# EAGLE board KMO_IO_MV2_91 (EAGLE 9.4.2)
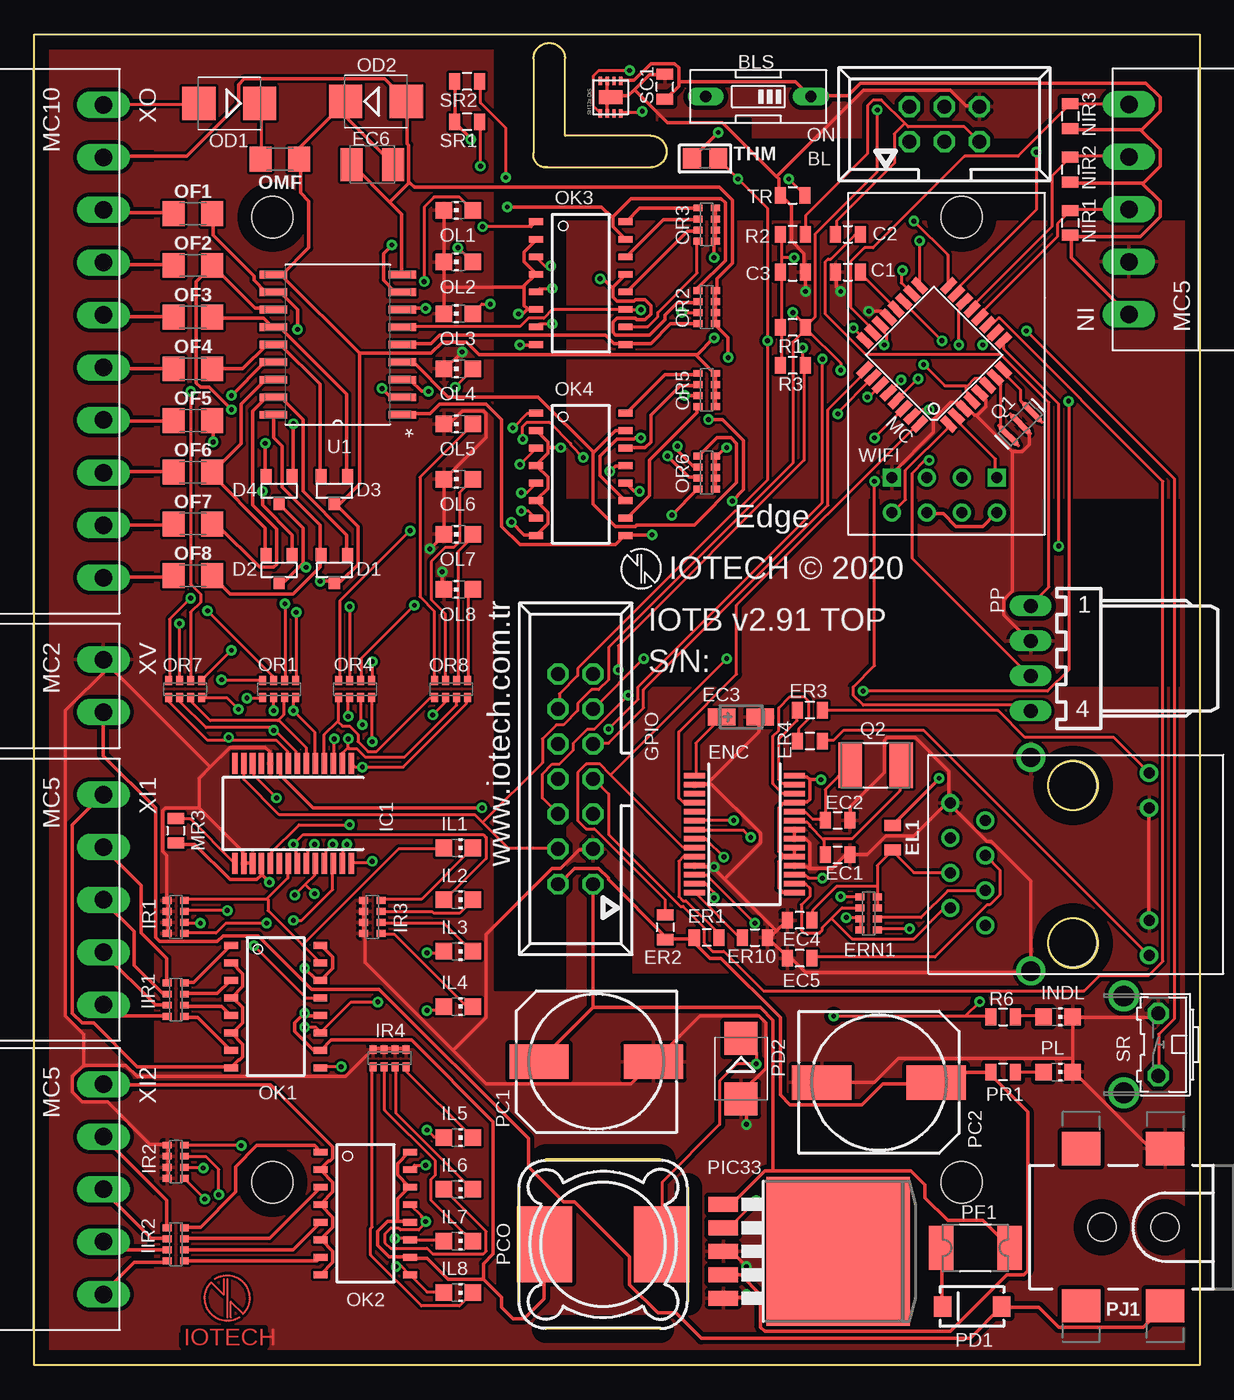
[diagram p2: board, top side]
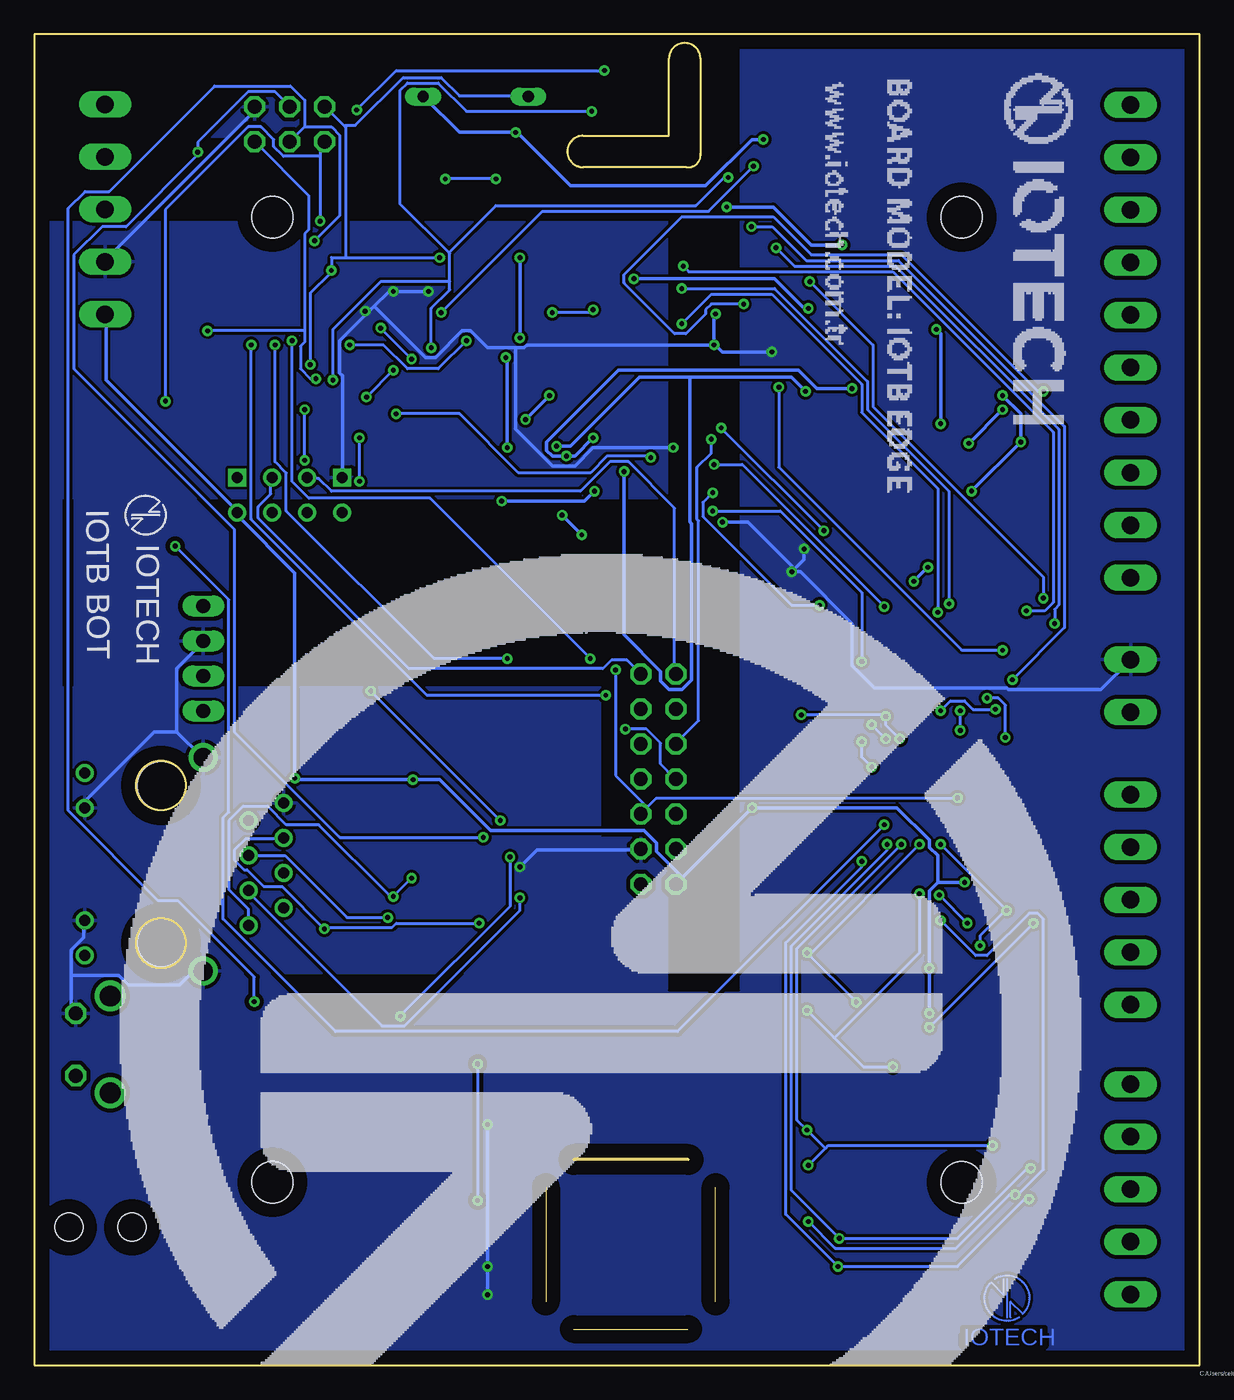
[diagram p3: board, bottom side, seen from below]

Size 84.5 x 96.5 mm. Coordinates in mm from the lower left corner, seen from the top.
Outline: 0,0 0,96.5 84.5,96.5 84.5,0 0,0
Outline: 36.2,94.74 36.2,87.88 arc106 37.21,86.87 44.7,86.87 arc180 44.7,89.15 38.48,89.15 38.48,94.74 arc180 36.2,94.74
Copper layers (1*16): Top 0.035mm / dielectric 1.5mm / Bottom 0.035mm
Design rules "KMO_IO_M": minimum track width 6mil, minimum drill 0.35mm, track to track 0.205mm, track to pad 0.205mm, pad to pad 0.205mm, via to via 0.205mm, smd to smd 6mil, copper to edge 40mil, drill to drill 6mil, minimum pad ring 10mil, minimum via ring 8mil, stop-mask expansion 4mil, vias tented up to drill 0mil, thermal gap 10mil
Net classes: 0 default: width 0.203 mm, drill 0.3 mm, clearance 0.16 mm; 1 COM1: width 0.254 mm, drill 0.3 mm, clearance 0.16 mm to class 0, clearance 0.16 mm; 2 3.3V: width 0.254 mm, drill 0.3 mm, clearance 0.16 mm to class 0, clearance 0.16 mm to class 1, clearance 0.16 mm; 3 MAX_24V: width 0.254 mm, drill 0.3 mm, clearance 0.16 mm to class 0, clearance 0.16 mm to class 1, clearance 0.16 mm to class 2, clearance 0.16 mm; 4 RAW: width 0.254 mm, drill 0.3 mm, clearance 0.16 mm to class 0, clearance 0.16 mm to class 1, clearance 0.16 mm to class 2, clearance 0.16 mm to class 3, clearance 0.16 mm; 5 COM2: width 0.254 mm, drill 0.3 mm, clearance 0.16 mm to class 0, clearance 0.16 mm to class 1, clearance 0.16 mm to class 2, clearance 0.16 mm to class 3, clearance 0.16 mm to class 4, clearance 0.16 mm
Holes 3 mm at 17.25,83.25 67.25,83.25 17.25,13.25 67.25,13.25

## Footprints (pad centres in the part's own frame; a part is rotated, then mirrored left to right if it is on the bottom)
057-006-1 = drill 1 octagon: 1 -2.54,-1.27; 2 -2.54,1.27; 3 0,-1.27; 4 0,1.27; 5 2.54,-1.27; 6 2.54,1.27
EDG-01 = drill 0.813 long: 1 0,-3.81; 2 0,3.81
0805 = smd 0.8 x 1.2: 1 -0.9,0; 2 0.9,0
SOT-23-3 = smd 0.802 x 0.972: 1 -0.95,-1; 2 0.95,-1; 3 0,1
CT3216 = smd 2 x 1.2: + -1.4,0; - 1.4,0
SMC_B = smd 1.6 x 2.4: + -1.5,0; - 1.5,0
SSOP28 = smd 0.4 x 1.5: 1 -4.225,-3.625; 2 -3.575,-3.625; 3 -2.925,-3.625; 4 -2.275,-3.625; 5 -1.625,-3.625; 6 -0.975,-3.625; 7 -0.325,-3.625; 8 0.325,-3.625; 9 0.975,-3.625; 10 1.625,-3.625; 11 2.275,-3.625; 12 2.925,-3.625; 13 3.575,-3.625; 14 4.225,-3.625; 15 4.225,3.625; 16 3.575,3.625; 17 2.925,3.625; 18 2.275,3.625; 19 1.625,3.625; 20 0.975,3.625; 21 0.325,3.625; 22 -0.325,3.625; 23 -0.975,3.625; 24 -1.625,3.625; 25 -2.275,3.625; 26 -2.925,3.625; 27 -3.575,3.625; 28 -4.225,3.625
0603-ARV = smd 0.5 x 0.65: 1 -1.2,-0.625; 2 -0.4,-0.625; 3 0.4,-0.625; 4 1.2,-0.625; 5 1.2,0.625; 6 0.4,0.625; 7 -0.4,0.625; 8 -1.2,0.625
057-014-1 = drill 1 octagon: 1 -7.62,-1.27; 2 -7.62,1.27; 3 -5.08,-1.27; 4 -5.08,1.27; 5 -2.54,-1.27; 6 -2.54,1.27; 7 0,-1.27; 8 0,1.27; 9 2.54,-1.27; 10 2.54,1.27; 11 5.08,-1.27; 12 5.08,1.27; 13 7.62,-1.27; 14 7.62,1.27
CHIP-LED0805 = smd 1.2 x 1.2: A 0,-1.05; C 0,1.05
TQFP32-08 = smd 1.27 x 0.559: 1 -4.293,2.8; 2 -4.293,2; 3 -4.293,1.2; 4 -4.293,0.4; 5 -4.293,-0.4; 6 -4.293,-1.2; 7 -4.293,-2; 8 -4.293,-2.8; 17 4.293,-2.8; 18 4.293,-2; 19 4.293,-1.2; 20 4.293,-0.4; 21 4.293,0.4; 22 4.293,1.2; 23 4.293,2; 24 4.293,2.8 | smd 0.559 x 1.27: 9 -2.8,-4.293; 10 -2,-4.293; 11 -1.2,-4.293; 12 -0.4,-4.293; 13 0.4,-4.293; 14 1.2,-4.293; 15 2,-4.293; 16 2.8,-4.293; 25 2.8,4.293; 26 2,4.293; 27 1.2,4.293; 28 0.4,4.293; 29 -0.4,4.293; 30 -1.2,4.293; 31 -2,4.293; 32 -2.8,4.293
MC5 = drill 1.27 long: 1 -7.62,0; 2 -3.81,0; 3 0,0; 4 3.81,0; 5 7.62,0
SMB = smd 2.4 x 2.4: A 2.2,0; C -2.2,0
1206 = smd 1.6 x 1.8: 1 -1.4,0; 2 1.4,0
MINI-FLAT-16 = smd 1 x 0.5: 1 -3.24,4.445; 2 -3.24,3.175; 3 -3.24,1.905; 4 -3.24,0.635; 5 -3.24,-0.635; 6 -3.24,-1.905; 7 -3.24,-3.175; 8 -3.24,-4.445; 9 3.24,-4.445; 10 3.24,-3.175; 11 3.24,-1.905; 12 3.24,-0.635; 13 3.24,0.635; 14 3.24,1.905; 15 3.24,3.175; 16 3.24,4.445
140CLH-1010 = smd 4.3 x 2.5: + 4.15,0; - -4.15,0
MSS1260 = smd 5.5 x 4: P$1 0,4.25; P$2 0,-4.25
SMA-DIODE = smd 1.27 x 1.47: A -2.15,0; C 2.15,0
1820 = smd 1.78 x 3.2: 1 -2.49,0; 2 2.49,0
TO263-5 = smd 1.067 x 2.159: 1 -3.404,-5.791; 2 -1.702,-5.791; 3 0,-5.791; 4 1.702,-5.791; 5 3.404,-5.791 | smd 10.8 x 10.41: 6 0,2.54
POWER_JACK_SMD_OVERPASTE_TOE = smd 2.8 x 2.4: GND 0,-5.7; P$4 6.1,-5.7; VIN0 0,5.7; VIN1 6.1,5.7 | hole 2.032: 0,0; 4.572,0
7395-04 = drill 1.016 long: 1 3.81,0; 2 1.27,0; 3 -1.27,0; 4 -3.81,0
RESONATOR-SMD-1:1 = smd 0.45 x 1.905: 1 -1.2,0; 2 0,0; 3 1.2,0
5.0X3.2_2 = smd 1.7 x 3.3: 1 -1.85,0; 2 1.85,0
SHT3X = smd 0.55 x 0.25: ADDR -1.175,0.25; ALERT -1.175,-0.25; GND 1.175,0.75; R 1.175,0.25; RESET 1.175,-0.25; SCL -1.175,-0.75; SDA -1.175,0.75; VDD 1.175,-0.75 | smd 1 x 1.7: GND_PAD 0,-0.025
B3F-31XX = drill 1.016 octagon: 1 -2.261,-1.245; 2 2.261,-1.245 | drill 1.499 pad 2.159: 3 -3.505,1.245; 4 3.505,1.245
MICROBUILDER_0805_NOTHERMALS = smd 1.3 x 1.5: 1 -0.95,0; 2 0.95,0
SOIC127P1030X265-18N = smd 1.981 x 0.559: 1 -4.674,5.08; 2 -4.674,3.81; 3 -4.674,2.54; 4 -4.674,1.27; 5 -4.674,0; 6 -4.674,-1.27; 7 -4.674,-2.54; 8 -4.674,-3.81; 9 -4.674,-5.08; 10 4.674,-5.08; 11 4.674,-3.81; 12 4.674,-2.54; 13 4.674,-1.27; 14 4.674,0; 15 4.674,1.27; 16 4.674,2.54; 17 4.674,3.81; 18 4.674,5.08
RJ45 = drill 0.8: G+ 5.84,-6.305; G- 5.84,-3.765; GND -8.57,4.76; NC -6.03,3.5; P4 -8.57,-0.32; P5 -6.03,0.96; RD+ -6.03,-1.58; RD- -8.57,2.22; TD+ -6.03,-4.12; TD- -8.57,-2.86; Y+ 5.84,6.945; Y- 5.84,4.405 | drill 1.4: SHIELD1 -2.73,-7.425; SHIELD2 -2.73,8.065 | hole 3.5: 0.3,-5.38; 0.3,6.02
ESP01 = drill 0.8: CH_PD -1.285,-8.178; GPIO0 1.255,-5.638; GPIO2 -1.285,-5.638; RST 1.255,-8.178; TX -3.825,-8.178; VCC 3.795,-8.178 | drill 0.8 square: GND -3.825,-5.638; RX 3.795,-5.638
MC10 = drill 1.27 long: 1 -17.145,0; 2 -13.335,0; 3 -9.525,0; 4 -5.715,0; 5 -1.905,0; 6 1.905,0; 7 5.715,0; 8 9.525,0; 9 13.335,0; 10 17.145,0
MC2 = drill 1.27 long: 1 -1.905,0; 2 1.905,0

## Placement (x,y rotation side)
BL  057-006-1  [057-006-1]  66,90 0 top
BLS  ON  [EDG-01]  52.5,92 90 top
C1  100nF  [0805]  59,79.26 0 top
C2  100nF  [0805]  59,82.01 0 top
C3  100nF  [0805]  55,79.26 0 top
D1  BAV70  [SOT-23-3]  21.75,57.75 180 top
D2  BAV70  [SOT-23-3]  17.75,57.75 180 top
D3  BAV70  [SOT-23-3]  21.75,63.5 180 top
D4  BAV70  [SOT-23-3]  17.75,63.5 180 top
EC1  18p  [0805]  58.25,37 0 top
EC2  18p  [0805]  58.25,39.5 0 top
EC3  10u  [CT3216]  51.25,47 0 top
EC4  10n  [0805]  55.5,32.25 180 top
EC5  10n  [0805]  55.5,29.5 180 top
EC6  10u 25V B  [SMC_B]  24.5,87.07 180 top
EL1  10µH  [0805]  62.25,38.25 270 top
ENC  ENC28J60-SSOP  [SSOP28]  51.5,38.5 270 top
ER1  10k  [0805]  48.75,31 180 top
ER2  10k  [0805]  45.75,31.75 270 top
ER3  1k  [0805]  56.25,47.5 180 top
ER4  1k  [0805]  56.25,45.25 180 top
ER10  2.7K  [0805]  52.25,31 0 top
ERN1  49.9R  [0603-ARV]  60.5,32.75 270 top
GPIO  057-014-1  [057-014-1]  39.25,42.5 90 top
IC1  MCP23017SS  [SSOP28]  18.75,40 180 top
IIR1  6.8K  [0603-ARV]  10.25,26.5 270 top
IIR2  6.8K  [0603-ARV]  10.25,8.75 270 top
IL1  BLU  [CHIP-LED0805]  30.75,37.5 270 top
IL2  BLU  [CHIP-LED0805]  30.75,33.75 270 top
IL3  BLU  [CHIP-LED0805]  30.75,30 270 top
IL4  BLU  [CHIP-LED0805]  30.75,26 270 top
IL5  BLU  [CHIP-LED0805]  30.75,16.5 270 top
IL6  BLU  [CHIP-LED0805]  30.75,12.75 270 top
IL7  BLU  [CHIP-LED0805]  30.75,9 270 top
IL8  BLU  [CHIP-LED0805]  30.75,5.25 270 top
INDL  BLU  [CHIP-LED0805]  74.25,25.25 270 top
IR1  10K  [0603-ARV]  10.25,32.5 90 top
IR2  10K  [0603-ARV]  10.25,14.75 90 top
IR3  1K  [0603-ARV]  24.5,32.5 270 top
IR4  1K  [0603-ARV]  25.75,22.25 180 top
MC  ATMEGA328  [TQFP32-08]  65.25,73.26 135 top
MR3  10K  [0805]  10.25,38.75 270 top
NI  MC5  [MC5]  79.38,83.82 90 top
NIR1  4700  [0805]  75.12,82.84 270 top
NIR2  4700  [0805]  75.12,86.7 270 top
NIR3  4700  [0805]  75.12,90.56 270 top
OD1  SS54  [SMB]  14.13,91.5 180 top
OD2  28V  [SMB]  24.77,91.64 0 top
OF1  200mA  [1206]  11.5,83.5 0 top
OF2  200mA  [1206]  11.5,79.75 0 top
OF3  200mA  [1206]  11.5,76 0 top
OF4  200mA  [1206]  11.5,72.25 0 top
OF5  200mA  [1206]  11.5,68.5 0 top
OF6  200mA  [1206]  11.5,64.75 0 top
OF7  200mA  [1206]  11.5,61 0 top
OF8  200mA  [1206]  11.5,57.25 0 top
OK1  TLP283-4  [MINI-FLAT-16]  17.5,26 0 top
OK2  TLP283-4  [MINI-FLAT-16]  24,11 0 top
OK3  TLP283-4  [MINI-FLAT-16]  39.63,78.46 0 top
OK4  TLP283-4  [MINI-FLAT-16]  39.62,64.59 0 top
OL1  BLU  [CHIP-LED0805]  30.75,83.75 90 top
OL2  BLU  [CHIP-LED0805]  30.75,80 90 top
OL3  BLU  [CHIP-LED0805]  30.75,76.25 90 top
OL4  BLU  [CHIP-LED0805]  30.75,72.25 90 top
OL5  BLU  [CHIP-LED0805]  30.75,68.25 90 top
OL6  BLU  [CHIP-LED0805]  30.75,64.25 90 top
OL7  BLU  [CHIP-LED0805]  30.75,60.25 90 top
OL8  BLU  [CHIP-LED0805]  30.75,56.25 90 top
OMF  2A  [1206]  17.8,87.45 180 top
OR1  1K  [0603-ARV]  17.75,49.02 180 top
OR2  10K  [0603-ARV]  48.75,76.72 270 top
OR3  10K  [0603-ARV]  48.75,82.72 270 top
OR4  1K  [0603-ARV]  23.25,49.02 180 top
OR5  10K  [0603-ARV]  48.75,70.72 270 top
OR6  10K  [0603-ARV]  48.75,64.72 270 top
OR7  1K  [0603-ARV]  10.92,49.02 180 top
OR8  1K  [0603-ARV]  30.23,49.02 180 top
PC1  220uf 50v  [140CLH-1010]  40.75,22 180 top
PC2  220uf 50v  [140CLH-1010]  61.25,20.5 0 top
PCO  220 uh  [MSS1260]  41.25,8.75 90 top
PD1  M7  [SMA-DIODE]  68,4.25 180 top
PD2  SS54  [SMB]  51.25,21.5 270 top
PF1  1A  [1820]  68.25,8.5 0 top
PIC33  LM2596S-3.3  [TO263-5]  55.75,8.25 270 top
PJ1  POWER_JACKTOE  [POWER_JACK_SMD_OVERPASTE_TOE]  82,10 180 top
PL  GRN  [CHIP-LED0805]  74.25,21.25 270 top
PP  22-05-7048-04  [7395-04]  72.25,51.25 90 top
PR1  1k  [0805]  70.25,21.25 180 top
Q1  8MHz  [RESONATOR-SMD-1:1]  71.5,68.26 45 top
Q2  25MHz  [5.0X3.2_2]  61,43.5 0 top
R1  1.5K  [0805]  55,75.25 180 top
R2  10K  [0805]  55,82.01 180 top
R3  1.5K  [0805]  55,72.5 180 top
R6  1k  [0805]  70.25,25.25 0 top
SC1  100nF  [0805]  45.72,92.71 90 top
SHT  SHT3X  [SHT3X]  41.78,91.95 90 top
SR  gnd  [B3F-31XX]  80.25,23.25 90 top
SR1  10K  [0805]  31.37,90.17 180 top
SR2  10K  [0805]  31.37,93.09 180 top
THM  THERM  [MICROBUILDER_0805_NOTHERMALS]  48.64,87.5 0 top
TR  10K  [0805]  54.99,84.84 0 top
U1  ULN2803ADW  [SOIC127P1030X265-18N]  22,74 180 top
U$1  [IOTECH_COPPER_W_TEXT]  13.98,4.86 0 top
U$2  HR911105A  [RJ45]  75,36 0 top
U$4  [IOTECH_COPPER_W_TEXT]  13.97,4.86 0 bottom
WIFI  ESP01  [ESP01]  66,70 0 top
XI1  MC5  [MC5]  5,33.75 270 top
XI2  MC5  [MC5]  5,12.75 270 top
XO  MC10  [MC10]  5,74.25 270 top
XV  MC2  [MC2]  5,49.25 270 top

## Tracks (layer width: path | path; a pad name or v marks a point on that pad's centre or on a via)
+3V3  (via drill 0.35)
  Top 0.254: PIC33.4 50.01,6.53 51.23,6.53 52.66,5.1 52.66,2.75 52.96,2.45 66.44,2.45 70.52,6.53 71.74,6.53 72.05,6.84 72.05,18.37 69.29,21.12 PR1.2 69.29,21.23 66.13,21.23 65.41,20.51 PC2.+ 65.31,20.41 61.54,20.41 60.01,18.88 54.8,18.88 54.09,19.59 54.09,25.21 49.8,29.49 48.98,29.49 47.66,30.82 ER1.2 47.76,30.92 45.82,30.92 ER2.2 45.82,31.02 41.64,35.21 41.64,35.31 40.92,36.02 39.19,36.02 38.06,34.9 GPIO.2 | 26.33,10.41 27.14,10.41 OK2.12 | 26.33,10.41 25.61,10.41 24.9,9.7 24.9,8.67 25.72,7.86 27.14,7.86 OK2.10 27.35,7.76 28.47,7.76 30,6.22 32.55,6.22 | 26.33,10.41 26.33,12.04 27.14,12.86 OK2.14 27.14,12.96 26.33,13.78 26.33,14.59 27.14,15.41 OK2.16 | 32.55,6.22 33.88,4.9 33.88,4.18 34.7,3.37 35.51,3.37 36.94,4.8 36.94,8.67 PCO.P$1 | 16.43,35.51 16.12,35.21 14.19,35.21 11.63,37.76 10.31,37.76 MR3.2 | 16.43,35.51 16.43,36.33 IC1.18 | OK1.16 20.82,30.41 21.64,29.59 21.64,28.78 20.82,27.96 OK1.14 20.72,27.96 20.41,27.96 v19.59,28.78 | 19.59,25.31 20.72,25.31 OK1.12 | 19.59,25.31 19.39,25.31 18.88,24.8 18.88,24.19 20.21,22.86 20.72,22.86 OK1.10 20.82,22.86 21.53,23.57 27.35,23.57 33.27,17.66 33.27,8.06 32.55,7.35 32.55,6.22 | v19.59,25.51 19.59,25.31 | v17.04,35 16.53,35.51 16.43,35.51 | v32.45,40.41 20.21,40.41 17.86,42.76 17.86,43.58 IC1.9 | 46.74,93.07 46.74,92.76 45.82,91.84 SC1.1 | 46.74,93.07 46.74,94.09 46.43,94.4 44.7,94.4 43.47,93.17 42.55,93.17 SHT.VDD | SR2.2 30.51,93.07 30.51,90.21 SR1.2 30.51,90.11 31.64,88.99 v31.64,88.89 | v49.6,89.4 47.76,87.56 THM.1 | 46.74,93.07 55.21,93.07 56.23,92.05 BLS.1 56.33,92.05 58.98,92.05 59.9,92.97 80.62,92.97 81.64,91.95 81.64,90.93 80.31,89.6 80.21,89.6
  Top 0.254: NI.1 79.29,76.23 75.21,80.31 75.21,81.84 NIR1.2 75.31,81.84 80.21,81.84 81.64,83.27 81.64,84.39 80.31,85.72 | 80.31,85.72 75.21,85.72 NIR2.2 | 80.21,89.6 75.21,89.6 NIR3.2 | 80.21,89.6 81.64,88.17 81.64,86.95 80.42,85.72 80.31,85.72 | 56.23,42.45 56.23,41.02 56.02,40.82 55.21,40.82 ENC.25 55.11,40.72 54.29,40.72 53.98,40.41 53.98,37.25 54.29,36.94 54.29,36.84 | 56.23,42.45 56.02,42.66 55.21,42.66 ENC.28 | 54.29,36.84 53.98,36.53 53.98,34.59 54.29,34.29 55.11,34.29 ENC.15 | 54.29,36.84 55.11,36.84 ENC.19 55.11,36.94 55.11,37.45 ENC.20 | v65.62,42.55 62.25,39.19 EL1.1 | WIFI.CH_PD 64.8,61.74 65.92,61.74 66.84,60.82 68.78,60.82 69.7,61.74 WIFI.VCC | v57.05,42.45 56.23,42.45
  Bottom 0.254: v19.59,25.51 v19.59,28.78 19.59,34.39 18.98,35 | 18.98,35 v17.04,35 | 18.98,35 18.98,36.94 19.59,37.55 19.59,38.06 21.94,40.41 v32.45,40.41 37.96,34.9 GPIO.2 37.55,35.41 39.39,37.25 39.39,37.86 40.31,38.78 51.43,38.78 55.11,42.45 v57.05,42.45 65.62,42.45 v65.62,42.55 65.62,57.45 69.7,61.54 69.7,61.74 WIFI.VCC 69.8,61.94 79.29,71.44 79.29,76.13 NI.1 | BLS.1 56.23,91.95 53.68,89.4 v49.6,89.4 49.49,89.4 45.62,85.52 35.82,85.52 32.45,88.89 v31.64,88.89
A0
  Top 0.203: NI.5 79.29,91.44 75.21,91.44 NIR3.1 75.11,91.44 71.33,87.66 67.45,87.66 60.82,81.03 60.21,81.03 59.19,80.01 59.19,76.74 60.72,75.21 60.72,74.91 MC.23
A1  (via drill 0.35)
  Top 0.203: v59.39,75.21 60.21,74.39 MC.24 | v57.15,72.97 57.15,62.56 43.78,49.19 43.78,48.27 v41.64,46.13
  Bottom 0.203: v57.15,72.97 v59.39,75.21 | v41.64,46.13 40.11,46.13 39.09,45.11 39.09,43.58 38.06,42.55 GPIO.8
A2
  Top 0.203: MC.25 60.21,72.15 60.21,71.94 57.56,69.29 57.56,62.35 44.19,48.98 44.19,47.66 41.64,45.11 40.62,45.11 GPIO.9
A3  (via drill 0.35)
  Top 0.203: v58.27,68.99 58.27,69.09 60.72,71.54 MC.26 | v39.8,65.82 38.88,66.74 38.88,66.84 37.35,68.37 35.72,68.37 35.41,68.07 v35.41,67.15
  Bottom 0.203: v58.27,68.99 53.68,68.99 49.39,64.7 44.19,64.7 42.96,65.92 39.9,65.92 v39.8,65.82 | v35.41,67.15 35.41,66.13 36.43,65.11 36.43,61.33 36.33,61.23 36.33,46.74 37.96,45.11 GPIO.10
A4  (via drill 0.35)
  Top 0.203: 32.5,39.34 34.39,37.45 37.96,37.45 GPIO.4 | 32.5,39.34 31.94,39.9 17.76,39.9 15.21,42.45 15.21,43.58 IC1.13 | v43.17,93.89 40.92,93.89 40.51,93.48 40.51,91.33 41.02,90.83 SHT.SDA | v61.13,91.03 61.13,86.54 56.64,82.05 56.64,76.03 55.92,75.31 R1.1 | v32.35,86.95 32.35,90.11 SR1.1 | v55.01,76.33 55.92,75.42 R1.1 | v60.41,70.21 60.52,70.21 61.33,71.03 MC.27 | v58.48,72.15 58.48,72.66 55.92,75.21 R1.1 | 32.5,39.34 36.84,43.68 36.84,45.41 37.86,46.43 38.37,46.43 39.39,47.45 39.39,47.96 40.41,48.98 40.92,48.98 41.64,49.7 41.64,52.05 55.01,65.41 55.01,74.19 55.92,75.11 R1.1
  Bottom 0.203: v43.17,93.89 58.27,93.89 v61.13,91.03 | v32.35,86.95 35.62,83.68 47.66,83.68 v55.01,76.33 | v58.48,72.15 v60.41,70.21
A5  (via drill 0.35)
  Top 0.203: v17.55,41.13 15.92,42.76 15.92,43.58 IC1.12 | v44.09,90.93 43.98,90.83 42.55,90.83 SHT.SCL | v55.72,73.78 55.72,72.66 55.82,72.56 R3.1 55.82,72.46 55.82,65.62 42.35,52.15 v42.35,50.41 | v34.19,86.13 34.19,89.7 32.35,91.54 32.35,93.07 SR2.1 | v62.86,71.44 61.94,70.52 MC.28
  Bottom 0.203: v17.55,41.13 39.39,41.13 40.51,40 GPIO.5 40.11,40.51 42.35,42.76 v42.35,50.41 | v44.09,90.93 53.17,90.93 55.21,92.97 57.45,92.97 57.96,92.46 57.96,84.19 54.44,80.67 | 54.44,80.67 54.39,80.62 54.39,78.58 | 54.39,78.58 54.39,77.97 55.72,76.64 v55.72,73.78 | v34.19,86.13 34.49,86.13 36.53,84.09 51.02,84.09 54.44,80.67 | v62.86,71.44 62.86,75.11 59.39,78.58 54.39,78.58
A6  (via drill 0.35)
  Top 0.203: v65.82,74.29 63.07,77.05 MC.19 | v44.19,51.23 40.62,47.66 GPIO.11
  Bottom 0.203: v65.82,74.29 65.82,64.09 64.6,62.86 55.82,62.86 v44.19,51.23
A7  (via drill 0.35)
  Top 0.203: v54.7,86.03 55.82,84.91 TR.2 | THM.2 49.6,87.46 v51.02,86.03 53.17,83.89 v53.17,74.29 53.17,64.19 50.92,61.94 50.82,61.94 39.39,50.52 39.39,50.01 38.06,48.68 38.06,47.66 GPIO.12 | v61.64,73.99 61.84,74.19 61.84,74.7 61.43,75.11 61.43,75.42 MC.22
  Bottom 0.203: v51.02,86.03 v54.7,86.03 | v61.64,73.99 59.19,73.99 57.45,72.25 55.21,72.25 v53.17,74.29
AREF
  Top 0.203: C1.2 59.9,79.19 62.45,76.64 MC.20
BLV  (via drill 0.35)
  Top 0.203: R3.2 54.19,72.56 54.19,75.21 R1.2 54.19,75.31 54.19,79.19 C3.1 54.19,79.29 54.19,80.31 | 54.19,80.31 54.19,81.95 R2.2 | 67.61,70.98 68.17,71.54 68.68,71.54 69.09,71.13 MC.6 | 67.61,70.98 67.56,70.92 67.56,70.62 67.97,70.21 67.97,70.01 MC.4 | v62.96,79.39 62.88,79.39 62.87,79.38 62.87,78.49 63.58,77.76 MC.18 | v64.5,72.56 66.03,71.03 67.56,71.03 67.61,70.98 | v55.11,80.31 54.19,80.31
  Bottom 0.203: 61.94,80.31 61.94,89.8 61.99,89.86 | 61.99,89.86 63.37,91.23 BL.2 | 64.5,77.74 v64.5,72.56 | 64.5,77.74 62.96,79.28 v62.96,79.39 62.96,80.31 61.94,80.31 | 64.5,77.74 | BLS.2 48.78,92.05 53.68,92.05 55.01,93.38 57.76,93.38 61.23,89.91 61.94,89.91 61.99,89.86 | 61.94,80.31 v55.11,80.31
COM1
  Top 0.254: OK1.2 14.29,29.19 15.1,28.37 15.1,27.45 14.29,26.64 OK1.4 14.39,26.64 15.1,25.92 15.1,24.8 14.39,24.08 OK1.6 14.29,24.08 15.1,23.27 15.1,22.35 14.9,22.14 14.8,22.14 14.29,21.64 OK1.8 14.19,21.64 7.45,21.64 4.29,24.8 3.47,24.8 2.75,25.51 2.75,39.19 4.9,41.33 XI1.1
COM2
  Top 0.254: OK2.8 20.82,6.63 21.64,7.45 21.64,8.27 20.82,9.08 OK2.6 20.82,9.18 21.64,10 21.64,10.71 20.82,11.53 OK2.4 20.82,11.74 21.64,12.55 21.64,13.27 20.82,14.08 OK2.2 20.82,14.29 21.33,14.8 21.43,14.8 21.64,15 21.64,15.82 17.14,20.31 5,20.31 XI2.1
D2
  Top 0.203: MC.32 64.19,68.17 63.98,68.17 50.92,55.11 50.92,50.11 46.74,45.92 46.74,41.13 47.05,40.82 47.86,40.82 ENC.4
D3
  Top 0.203: MC.1 66.23,68.17 66.23,67.97 63.17,64.9 63.17,62.76 62.25,61.84 WIFI.TX
D4
  Top 0.203: MC.2 66.94,68.78 66.94,68.48 69.7,65.72 69.7,64.39 WIFI.RX
D5  (via drill 0.35)
  Top 0.203: v74.29,59.39 74.29,69.7 70.31,73.68 70.31,74.29 MC.9 | v22.86,39.19 19.18,39.19 17.14,37.15 17.14,36.43 IC1.19
  Bottom 0.203: v74.29,59.39 70.42,55.52 70.42,40.11 70.82,39.7 70.82,32.35 62.66,24.19 37.86,24.19 v22.86,39.19
D6  (via drill 0.35)
  Top 0.203: v68.78,73.99 69.6,74.8 MC.10 | v43.06,48.58 40.62,46.13 40.11,46.13 39.09,45.11 39.09,44.6 38.06,43.58 37.55,43.58 36.84,42.86 36.84,41.13 37.96,40 GPIO.6
  Bottom 0.203: v68.78,73.99 68.78,61.33 56.02,48.58 v43.06,48.58
D7
  Top 0.203: MC.11 69.19,75.52 69.5,75.52 69.9,75.92 70.01,75.92 81.84,64.09 81.84,29.29 80.82,28.27 77.25,28.27 76.13,27.14 52.86,27.14 50.01,30 49.19,30 48.58,30.61 48.58,31.74 47.05,33.27 46.84,33.27 41.64,38.47 41.64,41.43 40.62,42.45 GPIO.7
D8
  Top 0.203: NI.3 79.29,83.78 75.21,83.78 NIR1.1 75.11,83.68 74.19,82.76 74.19,81.84 68.58,76.23 68.58,76.03 MC.12
D9
  Top 0.203: NI.4 79.29,87.66 75.21,87.66 NIR2.1 75.11,87.56 73.78,86.23 73.78,82.56 68.07,76.84 68.07,76.64 MC.13
D10  (via drill 0.35)
  Top 0.203: 41.79,42.81 47.05,37.55 47.86,37.55 ENC.9 | 41.79,42.81 41.02,43.58 40,43.58 39.39,42.96 39.39,39.49 40,38.88 40.62,38.88 45.72,33.78 45.72,32.66 ER2.1 | v67.05,73.99 67.05,76.54 67.35,76.84 67.35,77.05 MC.14 | 41.79,42.81 v50.21,51.23
  Bottom 0.203: v67.05,73.99 67.05,65.52 66.23,64.7 66.23,61.94 55.52,51.23 v50.21,51.23
D11  (via drill 0.35)
  Top 0.203: v72.66,87.97 72.66,83.78 66.94,78.07 66.94,77.76 MC.15 | v51.94,38.27 51.43,38.78 47.96,38.78 ENC.7
  Bottom 0.203: BL.4 66.03,91.33 67.05,92.36 68.99,92.36 72.66,88.68 v72.66,87.97 72.66,87.76 77.86,82.56 79.6,82.56 81.64,80.52 81.64,72.25 70.01,60.62 70.01,45.92 62.35,38.27 v51.94,38.27
D12  (via drill 0.35)
  Top 0.203: v63.78,82.97 66.23,80.52 66.23,78.37 MC.16 | v50.72,39.49 47.96,39.49 ENC.6 | v60.11,48.88 73.48,48.88 75.01,50.41 v75.01,69.9
  Bottom 0.203: 63.78,87.66 63.78,88.38 63.48,88.68 BL.1 | 63.78,87.66 v63.78,82.97 | v60.11,48.88 v50.72,39.49 | v75.01,69.9 75.01,83.78 68.99,89.8 68.07,89.8 67.15,88.89 67.15,88.38 66.44,87.66 63.78,87.66
D13  (via drill 0.35)
  Top 0.203: v64.19,81.54 64.19,78.37 MC.17 | v57.96,25.31 67.51,25.31 | 67.51,25.31 69.29,25.31 R6.1 | v50.01,36.84 48.68,38.17 47.96,38.17 ENC.8 | 67.51,25.31 v68.56,26.35
  Bottom 0.203: v64.19,81.54 62.35,83.38 62.35,89.19 62.97,89.8 64.9,89.8 | 64.9,89.8 65.92,88.78 BL.3 | v57.96,25.31 50.01,33.27 v50.01,36.84 | 64.9,89.8 64.9,91.74 65.92,92.76 71.44,92.76 79.09,85.11 80.82,85.11 82.05,83.89 82.05,40.21 75.52,33.68 74.09,33.68 68.56,28.15 v68.56,26.35
DTR
  Top 0.203: C2.2 59.8,81.95 59.49,81.95 57.76,80.21 57.56,80.21 57.35,80.01 57.35,76.23 60.31,73.27 70.11,73.27 73.58,69.8 73.58,56.43 72.25,55.11 PP.1
EP4
  Top 0.203: ERN1.7 61.13,33.17 61.13,33.88 ERN1.8 61.13,33.98 61.13,34.7 | 61.13,34.7 61.13,36.23 62.15,37.25 EL1.2 62.25,37.25 63.78,35.72 66.33,35.72 U$2.P4 | 61.13,34.7 58.17,34.7 56.43,32.96 56.43,32.35 EC4.1
EP5  (via drill 0.35)
  Top 0.203: ERN1.4 59.9,31.64 59.9,32.35 ERN1.3 59.8,32.45 v58.88,32.45 | EC5.1 56.43,29.59 65.31,29.59 69.09,33.37 69.29,33.37 70.01,34.09 70.01,35.92 68.99,36.94 U$2.P5
  Bottom 0.203: v58.88,32.45 61.84,32.45 66.33,36.94 68.88,36.94 U$2.P5
GND  (via drill 0.35)
  Top 0.254: IR2.8 9.7,13.57 9.7,14.29 IR2.7 9.7,14.39 9.7,15.1 IR2.6 9.7,15.21 9.7,15.92 IR2.5 9.59,16.02 8.37,16.02 5.31,19.08 3.47,19.08 2.75,19.8 2.75,20.92 3.57,21.74 | IR4.1 26.94,22.96 26.23,22.96 IR4.2 26.12,22.96 25.41,22.96 IR4.3 25.31,22.96 24.59,22.96 IR4.4 24.49,22.86 22.55,20.92 7.45,20.92 6.63,21.74 3.57,21.74 | 37.25,66.54 37.25,66.94 36.43,67.76 OK4.2 | 37.25,66.54 37.25,66.13 36.43,65.31 OK4.4 36.43,65.21 37.25,64.39 37.25,63.58 36.43,62.76 OK4.6 36.43,62.66 37.25,61.84 37.25,61.03 36.43,60.21 OK4.8 36.33,60.21 35.51,60.21 v34.59,61.13 | v29.57,57.53 29.57,56.38 OL8.C | v28.68,59.19 29.7,60.21 OL7.C 29.7,60.31 29.7,64.19 OL6.C 29.8,64.29 32.76,67.25 32.76,68.99 32.55,69.19 31.02,69.19 30.11,68.27 29.8,68.27 OL5.C | IR1.8 9.7,31.33 9.7,32.04 IR1.7 9.7,32.15 9.7,32.86 IR1.6 9.7,32.96 9.7,33.68 IR1.5 9.59,33.78 9.59,36.94 9.29,37.25 9.29,40.21 9.49,40.41 11.94,40.41 | 11.94,40.41 15.1,37.25 15.1,36.43 IC1.16 15.21,36.43 15.82,36.43 IC1.17 | 12.76,43.37 11.94,42.55 11.94,40.41 | 12.76,43.37 14.19,44.8 16.74,44.8 17.04,44.49 17.04,43.68 IC1.10 | 12.76,43.37 5,51.13 XV.1 5.41,50.62 2.25,47.45 2.25,25.31 3.57,23.98 3.57,21.74 | SHT.GND 41.13,93.17 41.43,93.17 SHT.R 41.53,93.07 41.53,92.25 41.74,92.05 SHT.GND_PAD | SHT.ADDR 41.53,90.83 41.53,91.74 41.74,91.95 SHT.GND_PAD | 43.52,92.51 43.06,92.05 41.84,92.05 SHT.GND_PAD | 43.52,92.51 44.6,93.58 45.72,93.58 SC1.2 | 43.52,92.51 45.92,90.11 49.9,90.11 53.83,86.18 | 53.83,86.18 53.98,86.03 53.98,84.91 TR.1 54.19,84.8 54.9,84.09 54.9,81.54 55.82,80.62 55.82,79.29 C3.2 55.92,79.19 v55.92,77.86
  Top 0.254: 53.83,86.18 60.11,92.46 66.44,92.46 67.56,91.33 68.48,91.33 BL.6 | 29.7,78.17 29.7,79.91 OL2.C 29.7,80.11 29.7,83.68 OL1.C | 29.7,78.17 29.7,76.33 OL3.C | v35.21,73.99 36.33,73.99 OK3.8 | v35.1,76.23 35.41,76.23 35.72,76.54 | 35.72,76.54 36.33,76.54 OK3.6 | 35.51,78.17 35.51,76.84 35.72,76.64 35.72,76.54 | 35.51,78.17 35.51,78.27 36.33,79.09 OK3.4 36.33,79.19 35.51,80.01 35.51,80.72 36.33,81.54 OK3.2 | v31.02,73.48 29.8,72.25 OL4.C | 35.51,78.17 29.7,78.17 | 68.37,68.88 68.17,68.88 67.76,69.29 67.45,69.29 MC.3 67.35,69.39 66.94,69.8 66.44,69.8 65.21,68.58 65.21,67.66 62.25,64.7 62.25,64.39 WIFI.GND | 68.37,68.88 68.99,69.5 68.99,70.01 68.58,70.42 MC.5 | 70.92,66.23 71.64,66.23 72.15,66.74 72.15,67.45 Q1.2 | 70.92,66.23 68.37,68.78 68.37,68.88 | v58.48,77.86 58.17,78.17 58.17,79.19 C1.1 | v60.52,76.44 61.43,76.44 61.84,76.03 MC.21 | v51.64,5.1 51.43,4.9 50.01,4.9 PIC33.5 | v51.64,7.14 50.62,8.16 50.01,8.16 PIC33.3 | IR3.1 23.88,33.68 23.88,32.96 IR3.2 23.88,32.86 23.88,32.15 IR3.3 23.88,32.04 23.88,31.33 IR3.4 23.98,31.23 23.98,29.19 30.36,22.81 | 30.36,22.81 32.76,20.41 43.27,20.41 44.8,21.94 PC1.- 45,22.04 48.27,25.31 52.56,25.31 53.07,24.8 53.07,21.53 51.33,19.8 51.33,19.39 PD2.A 51.23,19.18 51.64,18.78 v51.64,17.45 | 30.36,22.81 32.76,25.21 32.76,31.23 37.55,36.02 38.17,36.02 39.49,37.35 40.51,37.35 GPIO.3 | 48.93,42.3 52.56,45.92 52.56,46.94 EC3.- | 48.93,42.3 48.78,42.15 47.96,42.15 ENC.2 | 53.83,31.48 EC4.2 | 53.83,31.48 53.37,31.02 53.17,31.02 ER10.2 53.27,30.92 54.6,29.59 EC5.2 54.7,29.49 54.9,29.49 55.92,28.47 72.25,28.47 U$2.SHIELD1 72.25,28.68 72.25,35.1 69.39,37.96 69.09,37.96 66.54,40.51 66.54,40.72 U$2.GND
  Top 0.254: 49.19,36.13 47.96,36.13 ENC.11 | 53.83,31.48 50.06,35.26 | 50.06,35.26 49.19,36.13 | 48.93,42.3 52.66,38.58 52.66,37.86 50.06,35.26 | ENC.22 55.11,38.78 55.11,38.27 ENC.21 55.21,38.17 55.92,38.17 56.23,37.86 56.23,36.02 | 56.23,36.02 56.13,36.02 56.02,36.13 55.21,36.13 ENC.18 | 56.23,36.02 57.86,36.02 58.78,36.94 59.09,36.94 EC1.2 59.19,37.04 60.41,37.04 61.74,38.37 63.78,38.37 66.23,40.82 U$2.GND | EC2.2 59.19,39.59 59.19,40.51 61.64,42.96 61.64,45.31 61.84,45.51 63.88,45.51 66.33,43.06 66.33,40.82 U$2.GND | 75.31,22.25 75.31,25.21 INDL.C 75.42,25.21 81.23,25.21 81.44,25.41 SR.2 | 75.31,22.25 75.31,21.33 PL.C 75.42,21.23 80.93,15.72 81.95,15.72 PJ1.GND | U$2.Y- 80.82,40.31 80.82,32.25 U$2.G- | 75.31,22.25 62.66,22.25 60.92,20.51 57.15,20.51 PC2.- | v49.29,36.13 49.19,36.13 | 70.92,66.23 70.92,56.13 70.31,55.52 70.31,54.39 72.15,52.56 PP.2 | v38.17,66.54 37.25,66.54
  Bottom 0.254: v28.68,59.19 28.68,58.43 v29.57,57.53 | v34.59,61.13 32.76,61.13 29.57,57.94 v29.57,57.53 | v29.57,57.53 28.96,57.53 25.21,53.78 25.21,50.72 23.57,49.09 13.98,49.09 13.88,48.98 7.14,48.98 5,51.13 XV.1 | BL.6 68.58,91.23 68.58,90.93 79.39,80.11 NI.2 | v35.21,73.99 35.21,76.13 v35.1,76.23 | v31.02,73.48 34.59,73.48 35.1,73.99 v35.21,73.99 | 60.36,76.28 62.35,74.29 62.35,71.94 62.15,71.74 62.15,64.39 WIFI.GND | 60.36,76.28 59.85,76.79 | 59.85,76.79 58.78,77.86 v58.48,77.86 v55.92,77.86 | 60.36,76.28 v60.52,76.44 | v35.21,73.99 48.78,73.99 48.98,73.78 49.6,73.78 | 49.6,73.78 51.64,73.78 52.86,75.01 53.47,75.01 55.41,73.07 56.13,73.07 59.85,76.79 | v51.64,5.1 v51.64,7.14 v51.64,17.45 | 74.19,45.92 74.19,50.52 72.25,52.45 PP.2 | 74.19,45.92 72.35,44.09 U$2.SHIELD2 | 81.84,28.27 81.84,25.82 81.54,25.51 SR.2 | 81.84,28.27 81.84,30.11 80.93,31.02 80.93,32.15 U$2.G- | 81.84,28.27 78.37,28.27 77.66,27.55 73.99,27.55 72.97,28.57 72.35,28.57 U$2.SHIELD1 | 74.19,45.92 75.82,45.92 80.82,40.92 80.82,40.41 U$2.Y- | v49.29,36.13 48.07,37.35 40.62,37.35 GPIO.3 | v38.17,66.54 43.98,66.54 45.31,65.21 46.94,65.21 49.6,67.86 49.6,73.78
  pour Top (isolate 0.305): -3.12,98.3 87,98.3 87,-1.65 -3.94,-1.65 -3.94,97.48
  pour Bottom (isolate 0.305): -5.33,99.44 88.01,99.44 88.01,-3.17 -5.33,-3.17
  cutout Top: 38.48,94.74 44.96,94.74 44.96,88.9 38.48,88.9
  cutout Bottom: 38.48,94.74 44.96,94.74 44.96,88.9 38.48,88.9
  pour Top: 43.43,49.15 84.45,49.15 84.45,28.45 43.43,28.45
  pour Bottom: 43.43,49.15 84.45,49.15 84.45,28.45 43.43,28.45
  cutout Bottom: 45.34,90.42 51.94,90.42 51.94,84.58 45.34,84.58
  cutout Top: 45.34,90.42 51.94,90.42 51.94,84.58 45.34,84.58
  pour Bottom: 8.76,94.11 33.4,94.11 33.4,2.41 8.76,2.41
  pour Top: 8.76,94.11 33.4,94.11 33.4,2.41 8.76,2.41
  cutout Top: 33.4,96.52 38.35,96.52 38.48,96.65 38.48,27.18 33.4,27.18
  cutout Bottom: 33.4,96.52 38.35,96.52 38.48,96.65 38.48,27.18 33.4,27.18
  pour Bottom: 38.48,83.06 84.45,83.06 84.45,62.87 38.48,62.87
  pour Top: 38.48,83.06 84.45,83.06 84.45,62.87 38.48,62.87
  cutout Top: 84.58,83.06 38.35,83.06 38.35,88.9 84.58,88.9 84.58,82.93
  cutout Bottom: 84.58,83.06 38.35,83.06 38.35,88.9 84.58,88.9 84.58,82.93
GNDO  (via drill 0.35)
  Top 0.254: OR6.5 49.39,63.58 49.39,64.29 OR6.6 49.39,64.39 49.39,65.01 OR6.7 49.39,65.21 49.39,65.82 OR6.8 49.49,65.92 50.11,66.54 v50.21,66.54 | v50.31,73.07 50.31,74.5 49.39,75.42 OR2.5 49.39,75.62 49.39,76.23 OR2.6 49.39,76.44 49.39,77.05 OR2.7 49.39,77.15 49.39,77.86 OR2.8 49.49,77.97 49.49,78.78 50.62,79.91 50.62,84.5 49.7,85.42 27.55,85.42 27.25,85.72 27.14,85.72 | 25.77,84.34 23.06,87.05 EC6.- | 25.77,84.34 26.64,83.48 26.64,79.09 U1.9 | 27.14,85.72 27.14,88.48 27.04,88.58 27.04,91.64 OD2.A 26.94,91.74 25.41,93.27 15.21,93.27 14.8,92.86 14.8,91.44 11.02,87.66 5,87.66 XO.2 | 25.77,84.34 27.14,85.72
  Bottom 0.254: v50.21,66.54 50.21,72.97 v50.31,73.07
GPA0
  Top 0.203: 16.89,33.83 18.37,35.31 18.37,36.33 IC1.21 | 16.89,33.83 16.84,33.78 10.92,33.78 IR1.4 | 19.44,30.46 16.94,32.96 16.94,33.78 16.89,33.83 | 19.44,30.46 20.72,29.19 OK1.15 | 19.44,30.46 26.43,37.45 29.7,37.45 IL1.A
GPA1  (via drill 0.35)
  Top 0.203: v13.98,32.96 10.92,32.96 IR1.3 | IC1.22 18.98,36.43 18.98,37.25 18.78,37.45 v18.78,37.76 19.49,38.47 32.55,38.47 32.76,38.27 32.76,36.74 29.8,33.78 IL2.A | v15.92,30.41 19.7,26.64 20.72,26.64 OK1.13
  Bottom 0.203: v18.78,37.76 v13.98,32.96 14.08,32.96 15.92,31.12 v15.92,30.41
GPA2  (via drill 0.35)
  Top 0.203: v12.04,32.04 10.92,32.04 IR1.2 | v19.59,24.49 20.41,24.49 20.72,24.19 OK1.11 20.82,24.19 22.96,26.33 v24.9,26.33 | v28.47,29.9 29.7,29.9 IL3.A | v20.31,37.76 19.8,37.25 19.8,36.43 IC1.23
  Bottom 0.203: v19.59,24.49 v12.04,32.04 | v24.9,26.33 v28.47,29.9 28.27,29.8 v20.31,37.76
GPA3  (via drill 0.35)
  Top 0.203: v22.25,21.64 20.82,21.64 OK1.9 | v28.47,25.72 29.49,25.72 29.7,25.92 IL4.A | v16.84,32.04 13.88,32.04 13.16,31.33 10.92,31.33 IR1.1 | 19.64,34.85 20.31,35.51 20.31,36.33 IC1.24 | 19.64,34.85 v18.88,34.09 | 19.64,34.85 v20.31,34.19
  Bottom 0.203: v22.25,21.64 24.39,21.64 26.48,23.73 | v28.47,25.72 26.48,23.73 | v18.88,34.09 v16.84,32.04 | 26.48,23.73 20.31,29.9 v20.31,34.19
GPA4  (via drill 0.35)
  Top 0.203: v15,15.92 10.92,15.92 IR2.4 | v28.37,14.49 27.55,14.49 OK2.15 | v28.47,17.04 28.98,16.53 29.7,16.53 IL5.A | v21.64,37.76 21.12,37.25 21.12,36.43 IC1.25
  Bottom 0.203: v15,15.92 26.94,15.92 27.14,15.72 | v28.37,14.49 27.14,15.72 | 27.14,15.72 v28.47,17.04 29.19,17.76 29.19,30.21 v21.64,37.76
GPA5  (via drill 0.35)
  Top 0.203: v13.37,12.35 13.37,14.19 12.45,15.1 10.92,15.1 IR2.3 | OK2.13 28.06,10.82 28.06,10.71 v28.37,10.41 28.27,10.41 28.27,10.21 27.86,9.8 26.53,9.8 26.43,9.9 25.82,9.9 25.41,9.49 25.41,8.88 25.82,8.47 28.47,8.47 28.88,8.06 32.55,8.06 32.76,8.27 32.76,9.7 29.8,12.65 IL6.A | v18.78,32.25 19.39,32.25 21.64,34.49 21.64,36.33 IC1.26
  Bottom 0.203: v28.37,10.41 26.43,8.47 17.66,8.47 13.78,12.35 v13.37,12.35 13.16,12.35 11.33,14.19 11.33,32.35 11.74,32.76 12.35,32.76 15.41,29.7 16.23,29.7 v18.78,32.25
GPA6  (via drill 0.35)
  Top 0.203: v12.25,14.29 10.92,14.29 IR2.2 | v26.12,9.18 27.14,9.18 OK2.11 27.25,9.08 29.7,9.08 IL7.A | v22.66,37.76 22.35,37.45 22.35,36.43 IC1.27
  Bottom 0.203: v12.25,14.29 12.45,14.29 17.55,9.18 v26.12,9.18 29.59,12.65 29.59,30.41 22.66,37.35 v22.66,37.76
GPA7  (via drill 0.35)
  Top 0.203: v12.35,12.04 10.92,13.47 IR2.1 | v26.23,7.14 26.64,7.14 27.14,6.63 OK2.9 27.25,6.53 28.47,5.31 29.7,5.31 IL8.A | v24.49,36.53 24.39,36.43 23.06,36.43 IC1.28
  Bottom 0.203: v12.35,12.04 12.65,12.04 17.55,7.14 v26.23,7.14 30,10.92 30,30.61 24.49,36.13 v24.49,36.53
GPB0  (via drill 0.35)
  Top 0.203: v24.49,45.21 24.49,48.37 OR4.8 | IC1.1 23.06,43.58 23.27,43.37 v23.78,43.37 26.74,43.37 31.33,47.96 31.33,48.37 OR8.8
  Bottom 0.203: v24.49,45.21 24.49,44.09 v23.78,43.37
GPB1  (via drill 0.35)
  Top 0.203: v23.78,46.43 23.68,46.53 23.68,48.37 OR4.7 | v22.76,45.41 22.76,44.8 22.71,44.75 | 22.71,44.75 22.35,44.39 22.35,43.68 IC1.2 | OR8.7 30.61,48.37 30.61,47.86 26.84,44.09 23.98,44.09 23.37,44.7 22.76,44.7 22.71,44.75
  Bottom 0.203: v22.76,45.41 v23.78,46.43
GPB2  (via drill 0.35)
  Top 0.203: v22.76,47.05 22.76,48.37 OR4.6 | v21.74,45.41 21.74,43.68 IC1.3 | v28.88,47.15 29.8,48.07 29.8,48.37 OR8.6
  Bottom 0.203: v21.74,45.41 22.76,46.43 v22.76,47.05 22.86,47.15 v28.88,47.15
GPB3
  Top 0.203: 21.99,46.69 21.02,45.72 21.02,43.68 IC1.4 | 21.99,46.69 22.04,46.74 22.04,48.37 OR4.5 | 21.99,46.69 22.35,46.33 22.86,46.33 23.47,45.72 23.47,45.21 24.19,44.49 24.8,44.49 28.68,48.37 28.98,48.37 OR8.5
GPB4  (via drill 0.35)
  Top 0.203: v14.8,47.55 13.98,48.37 12.14,48.37 OR7.8 | OR1.8 18.88,48.37 18.78,48.27 v18.78,47.45 20.31,45.92 20.31,43.68 IC1.5
  Bottom 0.203: v14.8,47.55 16.43,47.55 17.04,48.17 18.06,48.17 v18.78,47.45
GPB5
  Top 0.203: 17.71,46.79 18.06,47.15 18.06,48.37 OR1.7 | 17.71,46.79 17.66,46.74 12.76,46.74 11.33,48.17 11.33,48.37 OR7.7 | 17.71,46.79 19.7,44.8 19.7,43.68 IC1.6
GPB6  (via drill 0.35)
  Top 0.203: 17.4,46.08 18.98,44.49 18.98,43.68 IC1.7 | 17.4,46.08 17.25,46.23 12.45,46.23 10.61,48.07 10.61,48.37 OR7.6 | v17.35,47.45 17.35,48.37 OR1.6 | v17.35,46.02 17.4,46.08
  Bottom 0.203: v17.35,46.02 v17.35,47.45
GPB7  (via drill 0.35)
  Top 0.203: 14.08,45.31 17.55,45.31 18.37,44.49 18.37,43.68 IC1.8 | 14.08,45.31 12.55,45.31 9.8,48.07 9.8,48.37 OR7.5 | v15.41,48.37 16.53,48.37 OR1.5 | 14.08,45.31 v14.08,45.51
  Bottom 0.203: v15.41,48.37 14.59,48.37 14.08,47.86 v14.08,45.51
IO5
  Top 0.254: 40.51,66.13 40.51,62.45 42.15,60.82 43.58,60.82 43.68,60.92 47.86,60.92 50.92,63.98 50.92,66.84 50.52,67.25 49.49,67.25 48.17,65.92 OR6.1 | 40.51,66.13 42.15,67.76 OK4.15 | U1.4 26.74,72.66 27.55,72.66 30,70.21 36.53,70.21 40.51,66.23 40.51,66.13
IO6  (via drill 0.35)
  Top 0.254: v46.64,66.64 46.64,66.33 47.76,65.21 48.07,65.21 OR6.2 | v28.57,70.62 28.06,70.62 27.25,71.44 26.74,71.44 U1.3 | v41.74,64.8 42.15,65.21 42.86,65.21 OK4.13
  Bottom 0.254: v46.64,66.64 45.62,66.64 40.62,71.64 36.94,71.64 | 36.94,71.64 29.59,71.64 v28.57,70.62 | v41.74,64.8 41.74,52.96 39.09,50.31 39.09,49.6 38.47,48.98 37.55,48.98 36.84,49.7 36.84,61.03 36.94,61.13 36.94,71.64
IO7  (via drill 0.35)
  Top 0.254: v45.92,65.92 47.45,64.39 48.07,64.39 OR6.3 | v43.98,67.25 43.58,67.25 43.47,67.15 42.25,67.15 41.02,65.92 41.02,64.5 42.86,62.66 OK4.11 | v25.21,70.82 25.82,70.21 26.64,70.21 U1.2
  Bottom 0.254: v43.98,67.25 45.31,65.92 v45.92,65.92 46.94,65.92 47.35,66.33 47.35,66.94 42.15,72.15 29.08,72.15 27.76,70.82 v25.21,70.82
IO8  (via drill 0.35)
  Top 0.254: v46.23,61.64 48.07,63.48 OR6.4 | v44.8,60.21 42.96,60.21 OK4.9 42.76,60.11 42.15,59.49 35.21,59.49 33.88,60.82 33.88,68.58 32.76,69.7 29.39,69.7 28.68,68.99 26.74,68.99 U1.1
  Bottom 0.254: v44.8,60.21 v46.23,61.64
LEDA
  Top 0.203: ER3.1 57.25,47.45 69.9,47.45 71.84,45.51 78.27,45.51 80.82,42.96 U$2.Y+
LEDB
  Top 0.203: ER4.1 57.25,45.31 57.96,45.31 58.68,46.02 64.5,46.02 80.82,29.7 U$2.G+
N$1
  Top 0.203: OD1.A 11.84,91.44 5,91.44 XO.1
N$2
  Top 0.254: PD1.C 65.82,4.29 65.82,8.47 PF1.1
N$3
  Top 0.203: MR3.1 10.31,39.59 11.33,39.59 14.49,36.43 IC1.15
N$4
  Top 0.203: OMF.2 16.43,87.46 16.43,91.44 OD1.C
N$5
  Top 0.203: R6.2 71.23,25.31 73.17,25.31 INDL.A
N$6
  Top 0.254: OF8.1 10,57.15 5,57.15 XO.10
N$7
  Top 0.254: D1.1 22.66,58.78 22.66,60.21 19.49,63.37 19.49,68.58 17.96,70.11 17.35,70.11 U1.17 17.25,70.11 16.74,70.11 15.82,69.19 15.82,62.35 17.55,60.62 17.55,58.07 17.35,57.86 16.33,57.86 13.27,60.92 12.96,60.92 OF7.2
N$8  (via drill 0.35)
  Top 0.203: v13.57,49.7 16.53,49.7 OR1.4 | v32.5,82.56 36.02,82.56 36.33,82.86 OK3.1
  Bottom 0.203: v13.57,49.7 9.8,53.47 9.8,68.07 21.84,80.11 28.52,80.11 30.99,82.55 31.24,82.55 31.25,82.56 v32.5,82.56
N$9
  Top 0.203: ER3.2 55.31,47.45 55.31,46.74 53.98,45.41 53.98,42.45 54.29,42.15 55.11,42.15 ENC.27
N$10
  Top 0.203: MC.8 70.31,72.15 70.31,71.94 71.54,70.72 71.54,69.92 Q1.3
N$11
  Top 0.203: PR1.1 71.23,21.23 73.17,21.23 PL.A
N$12
  Top 0.203: IR3.8 25.21,33.78 28.06,33.78 31.74,37.45 IL1.C
N$13
  Top 0.203: ENC.1 47.96,42.76 47.96,45.11 49.8,46.94 EC3.+
N$14
  Top 0.203: ER4.2 55.41,45.31 55.41,46.13 56.13,46.84 56.13,48.17 55.82,48.47 54.8,48.47 53.98,47.66 53.98,46.02 53.58,45.62 53.58,42.15 54.29,41.43 55.11,41.43 ENC.26
N$15
  Top 0.203: MC.7 69.7,71.54 70.11,71.13 70.11,68.07 Q1.1
N$16  (via drill 0.35)
  Top 0.203: v52.35,11.94 50.41,10 50.01,10 PIC33.2 | PD2.C 51.33,23.68 52.35,22.66 v52.35,21.84 50.92,21.84 49.7,20.61 49.7,17.45 45.51,13.27 45.51,8.78 PCO.P$2
  Bottom 0.203: v52.35,21.84 v52.35,11.94
N$17
  Top 0.203: ER1.1 49.6,31.02 49.6,31.33 47.25,33.68 47.05,33.68 46.74,33.98 46.74,36.53 47.05,36.84 47.86,36.84 ENC.10
N$18
  Top 0.254: IIR1.1 9.59,27.76 9.59,29.49 7.76,31.33 7.76,34.8 XI1.2
N$19
  Top 0.203: ER10.1 51.33,31.02 51.13,31.02 47.96,34.19 ENC.14
N$20
  Top 0.203: IR3.7 25.21,32.86 28.88,32.86 28.98,32.76 30.82,32.76 31.74,33.68 IL2.C
N$21
  Top 0.203: IR3.6 25.21,32.04 29.7,32.04 31.74,30 IL3.C
N$22
  Top 0.203: ENC.24 55.21,40.11 55.92,40.11 56.43,39.59 57.25,39.59 EC2.1 57.35,39.59 57.35,41.74 59.09,43.47 Q2.1
N$23
  Top 0.203: IR3.5 25.21,31.23 26.12,31.23 31.33,26.02 31.74,26.02 IL4.C
N$24
  Top 0.203: 57.2,38.12 56.23,39.09 56.23,39.19 56.02,39.39 55.21,39.39 ENC.23 | 57.2,38.12 57.25,38.06 57.25,37.04 EC1.1 | 57.2,38.12 57.25,38.17 59.29,38.17 62.76,41.64 62.76,43.47 Q2.2
N$25
  Top 0.203: IR4.8 27.04,21.53 27.04,21.23 31.74,16.53 IL5.C
N$26
  Top 0.203: IR4.7 26.23,21.53 26.23,18.27 31.74,12.76 IL6.C
N$27
  Top 0.203: IR4.6 25.41,21.53 25.41,18.47 29.08,14.8 29.08,13.78 28.78,13.47 28.78,11.94 31.74,8.98 IL7.C
N$28
  Top 0.254: IIR1.2 9.59,26.94 9.29,26.94 7.25,28.98 7.25,31.43 5,33.68 XI1.3
N$29
  Top 0.254: IIR1.8 10.92,27.76 11.53,27.76 14.19,30.41 OK1.1
N$30
  Top 0.254: IIR1.7 10.92,26.94 13.27,26.94 14.19,27.86 OK1.3
N$31
  Top 0.254: IIR1.6 10.92,26.02 13.57,26.02 14.19,25.41 OK1.5
N$32
  Top 0.254: IIR1.5 10.92,25.21 11.84,25.21 14.19,22.86 OK1.7
N$33
  Top 0.254: IIR1.3 9.59,26.12 8.78,26.12 5,29.9 XI1.4
N$34
  Top 0.254: IIR1.4 9.59,25.31 5.82,25.31 XI1.5
N$35  (via drill 0.35)
  Top 0.203: v12.55,54.7 17.35,49.9 17.35,49.7 OR1.3 | v37.45,79.7 37.04,79.7 36.43,80.31 OK3.3
  Bottom 0.203: v12.55,54.7 11.23,54.7 10.61,55.31 10.61,67.66 22.25,79.29 37.04,79.29 v37.45,79.7
N$36
  Top 0.254: IIR2.1 9.59,10 9.59,11.94 5,16.53 XI2.2
N$37
  Top 0.254: IIR2.8 10.92,10 12.04,10 14.59,12.55 14.59,14.39 16.12,15.92 20.31,15.92 20.72,15.51 OK2.1
N$38
  Top 0.254: IIR2.2 9.59,9.18 8.47,9.18 5,12.65 XI2.3
N$39
  Top 0.254: IIR2.7 10.92,9.18 17.04,9.18 20.72,12.86 OK2.3
N$40
  Top 0.254: IIR2.3 9.59,8.37 5.51,8.37 5,8.88 XI2.4
N$41
  Top 0.254: IIR2.6 10.92,8.37 18.78,8.37 20.72,10.31 OK2.5
N$42
  Top 0.254: IIR2.4 9.59,7.45 7.25,7.45 5,5.21 XI2.5
N$43
  Top 0.254: IIR2.5 10.92,7.55 20.51,7.55 20.72,7.76 OK2.7
N$44
  Top 0.203: IR4.5 24.49,21.53 24.49,10 24.39,9.9 24.39,7.96 28.06,4.29 30.82,4.29 31.74,5.21 IL8.C
N$45  (via drill 0.35)
  Top 0.203: v18.16,55.21 18.16,49.7 OR1.2 | v37.55,78.07 36.64,78.07 36.43,77.86 OK3.5
  Bottom 0.203: v18.16,55.21 18.16,63.37 24.08,69.29 24.08,71.33 30.82,78.07 v37.55,78.07
N$46  (via drill 0.35)
  Top 0.203: v18.98,54.6 18.98,49.7 OR1.1 | v37.55,75.52 36.64,75.52 36.43,75.31 OK3.7
  Bottom 0.203: v18.98,54.6 18.98,63.58 24.49,69.09 24.49,71.13 31.02,77.66 35.41,77.66 v37.55,75.52
N$47
  Top 0.254: OF8.2 12.96,57.15 14.19,55.92 18.78,55.92 20.72,57.86 20.72,58.68 D1.2 20.72,58.78 20.72,60.92 17.96,63.68 17.96,66.64 17.35,67.25 17.35,68.88 U1.18
N$48
  Top 0.254: OR3.1 48.07,83.89 43.88,83.89 42.96,82.97 OK3.16
N$49
  Top 0.254: D2.2 16.74,58.78 16.74,60.72 12.96,64.5 12.96,64.7 OF6.2 12.96,64.8 15,66.84 15,69.7 16.74,71.44 17.25,71.44 U1.16
N$50  (via drill 0.35)
  Top 0.254: v16.53,63.37 16.53,62.35 18.68,60.21 18.68,58.78 D2.1 | v12.96,66.94 12.96,68.48 OF5.2 | v14.29,70.31 16.63,72.66 17.25,72.66 U1.15
  Bottom 0.254: v16.53,63.37 v12.96,66.94 12.96,68.99 v14.29,70.31
N$51
  Top 0.254: OF7.1 10,60.92 5,60.92 XO.9
N$52
  Top 0.254: OF6.1 10,64.8 5,64.8 XO.8
N$53
  Top 0.254: OR3.2 48.07,83.07 45.62,83.07 42.96,80.42 OK3.14
N$54
  Top 0.254: OF5.1 10,68.48 5,68.48 XO.7
N$55
  Top 0.254: OF4.1 10,72.25 5,72.25 XO.6
N$56
  Top 0.254: OR3.3 48.07,82.25 47.35,82.25 42.96,77.86 OK3.12
N$57
  Top 0.254: D3.1 22.66,64.6 22.66,70.42 17.86,75.21 17.35,75.21 U1.13 17.25,75.31 16.63,75.92 12.96,75.92 OF3.2
N$58
  Top 0.203: OR3.4 48.07,81.44 48.07,79.19 45.21,76.33 45.21,76.03 44.49,75.31 42.96,75.31 OK3.10
N$59  (via drill 0.35)
  Top 0.254: v16.74,66.84 16.74,64.6 D4.2 | v14.29,69.29 12.65,70.92 12.04,70.92 11.74,71.23 11.74,78.58 12.86,79.7 OF2.2 12.96,79.7 16.02,76.64 17.25,76.64 U1.12
  Bottom 0.254: v14.29,69.29 v16.74,66.84
N$60  (via drill 0.35)
  Top 0.203: v11.33,55.62 9.8,54.09 9.8,49.7 OR7.4 | v28.27,78.58 28.27,83.99 28.98,84.7 30.82,84.7 31.74,83.78 OL1.A
  Bottom 0.203: v11.33,55.62 11.33,57.15 23.68,69.5 23.68,73.99 v28.27,78.58
N$61  (via drill 0.35)
  Top 0.203: v10.51,53.78 10.51,49.7 OR7.3 | v30.72,81.03 31.74,80.01 OL2.A
  Bottom 0.203: v10.51,53.78 10.51,54.8 10.21,55.11 10.21,67.86 22.04,79.7 29.39,79.7 v30.72,81.03
N$62  (via drill 0.35)
  Top 0.203: v11.33,70.62 11.33,56.64 12.04,55.92 12.04,55.31 11.33,54.6 11.33,49.7 OR7.2 | v33.06,76.95 32.45,76.95 31.84,76.33 OL3.A
  Bottom 0.203: v11.33,70.62 11.74,70.62 21.64,80.52 28.17,80.52 30.92,83.27 37.55,83.27 41.74,79.09 41.74,78.48 38.06,74.8 37.25,74.8 35.82,76.23 35.82,76.54 35.41,76.95 v33.06,76.95
N$63  (via drill 0.35)
  Top 0.203: v14.29,51.84 12.14,49.7 OR7.1 | v30.51,70.92 31.74,72.15 OL4.A
  Bottom 0.203: v14.29,51.84 17.25,51.84 30.51,65.11 v30.51,70.92
N$64  (via drill 0.35)
  Top 0.254: v18.78,68.27 18.78,64.6 D4.1 | v19.08,75.11 19.08,76.54 17.86,77.76 17.35,77.76 U1.11 17.25,77.86 16.74,77.86 15.92,78.68 15.92,78.99 12.96,81.95 12.96,83.48 OF1.2
  Bottom 0.254: v18.78,68.27 18.78,74.8 v19.08,75.11
N$65
  Top 0.254: D3.2 20.72,64.6 20.72,71.13 17.86,73.99 17.35,73.99 U1.14 17.25,73.99 16.84,73.99 15.1,72.25 12.96,72.25 OF4.2
N$66
  Top 0.254: OF3.1 10,76.03 5.1,76.03 5,76.13 XO.5
N$67
  Top 0.254: OF2.1 10,79.8 5.1,79.8 5,79.91 XO.4
N$68
  Top 0.254: OF1.1 10,83.58 5.1,83.58 5,83.68 XO.3
N$69  (via drill 0.35)
  Top 0.203: v27.25,60.52 22.14,55.41 22.14,49.7 OR4.4 | v34.7,67.97 35.72,68.99 36.33,68.99 OK4.1
  Bottom 0.203: v34.7,67.97 v27.25,60.52
N$70  (via drill 0.35)
  Top 0.203: v22.86,55.01 22.86,49.7 OR4.3 | v35.21,65.31 36.33,66.44 OK4.3
  Bottom 0.203: v22.86,55.01 33.17,65.31 v35.21,65.31
N$71  (via drill 0.35)
  Top 0.203: v27.55,55.11 23.68,51.23 23.68,49.7 OR4.2 | v35.31,63.27 35.72,63.27 36.33,63.88 OK4.5
  Bottom 0.203: v27.55,55.11 29.59,55.11 36.02,61.54 36.02,62.56 v35.31,63.27
N$72  (via drill 0.35)
  Top 0.203: v24.49,51.02 24.49,49.7 OR4.1 | v35.31,61.94 35.82,61.94 36.33,61.43 OK4.7
  Bottom 0.203: v24.49,51.02 24.49,56.02 30.41,61.94 v35.31,61.94
N$73
  Top 0.254: OR5.1 48.07,71.84 45.72,71.84 42.96,69.09 OK4.16
N$74
  Top 0.254: OR5.2 48.07,71.03 46.84,71.03 44.7,68.88 44.7,66.94 44.29,66.54 42.96,66.54 OK4.14
N$75  (via drill 0.35)
  Top 0.254: v47.15,70.31 48.07,70.31 OR5.3 | v48.88,68.58 49.9,68.58 51.43,67.05 51.43,63.48 v50.62,62.66 | v43.88,63.37 43.47,63.37 42.96,63.88 OK4.12
  Bottom 0.254: v48.88,68.58 v47.15,70.31 | v50.62,62.66 44.6,62.66 v43.88,63.37
N$76
  Top 0.254: OR5.4 48.07,69.5 48.07,69.09 44.6,65.62 44.6,63.07 42.96,61.43 OK4.10
N$77
  Top 0.203: OR8.4 28.98,49.7 28.98,54.7 27.96,55.72 27.96,64.39 31.74,68.17 OL5.A
N$78
  Top 0.203: OR8.3 29.8,49.7 29.8,54.49 28.78,55.52 28.78,58.27 29.8,59.29 30.41,59.29 30.82,59.7 30.82,63.27 31.74,64.19 OL6.A
N$79
  Top 0.203: OR8.2 30.72,49.7 30.72,58.98 31.74,60.01 31.74,60.21 OL7.A
N$80
  Top 0.203: OR8.1 31.43,49.7 31.43,55.92 31.74,56.23 OL8.A
OI1  (via drill 0.35)
  Top 0.254: 41.94,83.27 43.27,84.6 49.8,84.6 50.11,84.29 50.11,80.11 48.17,78.17 48.17,77.97 OR2.1 | 41.94,83.27 41.94,82.56 OK3.15 | v25.92,81.23 25.31,80.62 25.31,78.68 26.12,77.86 26.64,77.86 U1.8 | v34.29,83.99 41.13,83.99 41.84,83.27 41.94,83.27
  Bottom 0.254: v25.92,81.23 28.17,81.23 30.92,83.99 v34.29,83.99
OI2  (via drill 0.35)
  Top 0.254: 41.94,78.17 41.94,77.46 42.25,77.15 43.47,77.15 43.58,77.25 44.29,77.25 44.7,76.84 44.7,76.23 44.29,75.82 43.68,75.82 43.58,75.92 42.25,75.92 41.94,75.62 41.94,74.91 42.15,74.7 44.6,74.7 45.72,75.82 45.72,76.13 46.64,77.05 48.07,77.05 OR2.2 | 41.94,78.17 42.86,79.09 OK3.13 | v28.37,76.64 26.74,76.64 U1.7 | v41.02,78.78 41.23,78.78 41.84,78.17 41.94,78.17
  Bottom 0.254: v28.37,76.64 28.68,76.64 30.82,78.78 v41.02,78.78
OI3  (via drill 0.35)
  Top 0.203: v46.94,76.33 48.07,76.33 OR2.3 | v43.98,76.54 42.96,76.54 OK3.11 42.86,76.54 37.55,76.54 36.94,75.92 35.82,75.92 35.21,75.31 26.74,75.31 U1.6
  Bottom 0.203: v46.94,76.33 44.19,76.33 v43.98,76.54
OI4
  Top 0.254: OR2.4 48.07,75.52 46.13,75.52 44.7,74.09 42.96,74.09 OK3.9 42.76,74.09 42.05,74.09 41.43,74.7 29.39,74.7 28.78,74.09 26.74,74.09 U1.5
RAW_IV
  Top 0.254: 40.51,25.92 40.51,34.8 GPIO.1 | 40.51,25.92 36.64,22.04 PC1.+ | 53.58,14.08 63.58,14.08 64.6,13.06 64.6,12.14 66.23,10.51 68.78,10.51 70.72,8.57 PF1.2 | 53.58,14.08 52.96,14.08 50.62,11.74 50.01,11.74 PIC33.1 | 40.51,25.92 52.66,25.92 53.58,25 53.58,14.08
RD+  (via drill 0.35)
  Top 0.203: ERN1.6 61.13,32.45 64.29,32.45 66.23,34.39 68.88,34.39 U$2.RD+ | v49.29,33.88 49.29,34.29 48.68,34.9 47.96,34.9 ENC.13
  Bottom 0.203: v49.29,33.88 49.29,32.96 57.66,24.59 59.29,24.59 68.88,34.19 68.88,34.39 U$2.RD+
RD-  (via drill 0.35)
  Top 0.203: v63.48,31.64 61.13,31.64 ERN1.5 | v52.25,32.04 48.78,35.51 47.96,35.51 ENC.12
  Bottom 0.203: U$2.RD- 66.44,38.17 69.19,38.17 70.01,37.35 70.01,36.64 69.29,35.92 69.09,35.92 67.86,34.7 66.54,34.7 v63.48,31.64 63.48,31.74 58.58,31.74 58.27,32.04 v52.25,32.04
RESET  (via drill 0.35)
  Top 0.203: 63.12,90.06 63.37,89.8 67.45,89.8 68.48,88.78 BL.5 | 63.12,90.06 61.43,91.74 60.82,91.74 60.41,91.33 60.41,87.86 55.92,83.38 55.92,82.05 R2.1 | 63.12,90.06 62.35,89.29 62.35,87.15 58.17,82.97 58.17,82.05 C2.1 | v64.09,71.54 62.56,70.01 MC.29 | v71.94,75.01 82.66,64.29 82.66,25.1 81.54,23.98 81.54,21.02 SR.1
  Bottom 0.203: v64.09,71.54 64.5,71.54 65.21,72.25 65.21,73.88 64.9,74.19 64.9,75.01 | 64.9,75.01 64.9,82.05 64.6,82.35 64.6,84.8 68.48,88.68 BL.5 | 64.9,75.01 v71.94,75.01
RXI  (via drill 0.35)
  Top 0.203: v60.92,67.25 62.97,69.29 MC.30 | v60.92,64.09 60.92,50.72 59.39,49.19 59.39,48.58 60.11,47.86 71.74,47.86 72.15,47.45 PP.4
  Bottom 0.203: v60.92,64.09 v60.92,67.25
TD+  (via drill 0.35)
  Top 0.203: v58.48,33.98 59.8,33.98 ERN1.1 | v57.15,35.31 56.13,35.31 55.92,35.51 55.21,35.51 ENC.17
  Bottom 0.203: v57.15,35.31 v58.48,33.98 58.48,34.09 58.78,34.09 63.88,39.19 66.23,39.19 67.56,40.51 69.39,40.51 70.42,39.49 70.42,34.49 68.99,33.06 68.99,31.94 U$2.TD+
TD-
  Top 0.203: 57.81,32.4 57.15,31.74 57.15,31.53 56.94,31.33 55.82,31.33 55.62,31.53 55.62,33.37 56.23,33.98 56.23,34.59 55.92,34.9 55.21,34.9 ENC.16 | 57.81,32.4 58.58,33.17 59.8,33.17 ERN1.2 | 57.81,32.4 59.29,30.92 63.78,30.92 65.92,33.06 66.33,33.06 U$2.TD-
TXO  (via drill 0.35)
  Top 0.203: v64.9,69.29 64.39,69.29 63.98,68.88 63.68,68.88 MC.31 | v64.9,65.62 64.6,65.62 63.68,64.7 63.68,58.48 72.15,50.01 PP.3
  Bottom 0.203: v64.9,65.62 v64.9,69.29
VDDO  (via drill 0.35)
  Top 0.254: EC6.+ 25.92,87.15 22.04,91.03 OD2.C 22.55,91.64 19.29,88.38 19.29,87.46 OMF.1 19.29,87.36 19.29,85.01 19.9,84.39 19.9,81.03 17.96,79.09 U1.10 17.35,78.99 17.96,78.99 23.57,73.37 | 19.44,58.12 19.49,58.17 19.49,60.72 17.76,62.45 D4.3 | 19.44,58.12 18.16,56.84 17.76,56.84 D2.3 | OR3.8 49.39,83.89 49.39,83.17 OR3.7 49.39,83.07 49.39,82.35 OR3.6 49.39,82.25 49.39,81.54 OR3.5 49.29,81.44 v49.29,80.31 | OR5.5 49.39,69.6 49.39,70.31 OR5.6 49.39,70.42 49.39,71.03 OR5.7 49.39,71.23 49.39,71.84 OR5.8 49.29,71.94 48.02,73.22 | 48.02,73.22 47.96,73.27 32.25,73.27 31.33,74.19 29.59,74.19 28.78,73.37 23.57,73.37 | 48.02,73.22 v49.29,74.5 | 23.57,73.37 23.57,63.88 22.04,62.35 D3.3 21.84,62.45 23.47,60.82 23.47,58.07 22.25,56.84 21.84,56.84 D1.3 21.74,56.84 v20.72,56.84 | v19.7,57.86 19.44,58.12
  Bottom 0.254: v49.29,74.5 v49.29,80.31 | v20.72,56.84 v19.7,57.86
VIN
  Top 0.254: PJ1.VIN0 81.95,4.29 80.42,2.75 74.29,2.75 72.86,4.18 70.21,4.18 PD1.A 70.11,4.18 67.86,1.94 48.37,1.94 46.53,3.78 45.21,3.78 43.17,5.82 43.17,7.86 39.19,11.84 38.37,11.84 35.82,14.39 35.82,16.43 25,27.25 20.1,27.25 16.23,31.12 13.68,31.12 13.27,30.72 9.08,30.72 8.78,31.02 8.78,40.41 5,44.19 5,47.25 XV.2
WFGPIO0
  Bottom 0.203: WIFI.GPIO0 67.35,64.29 67.35,63.17 68.27,62.25 68.27,61.43 57.35,50.52 43.27,50.52 42.66,51.13 41.53,51.13 40.62,50.21 GPIO.13
WFGPIO2
  Bottom 0.203: WIFI.GPIO2 64.7,64.29 63.88,64.29 62.97,63.37 44.9,63.37 42.76,65.52 41.43,65.52 38.06,62.15 38.06,50.21 GPIO.14

## Text on the board
tPlace: ON | Edge | IOTECH © 2020 | IOTB v2.91 TOP | S/N: | www.iotech.com.tr
bPlace: IOTB BOT | IOTECH
bNames: C:/Users/celikada/Downloads/5.bmp